# Altium schematic sheet LM317_PSU.SchDoc
size 234 x 100 mm
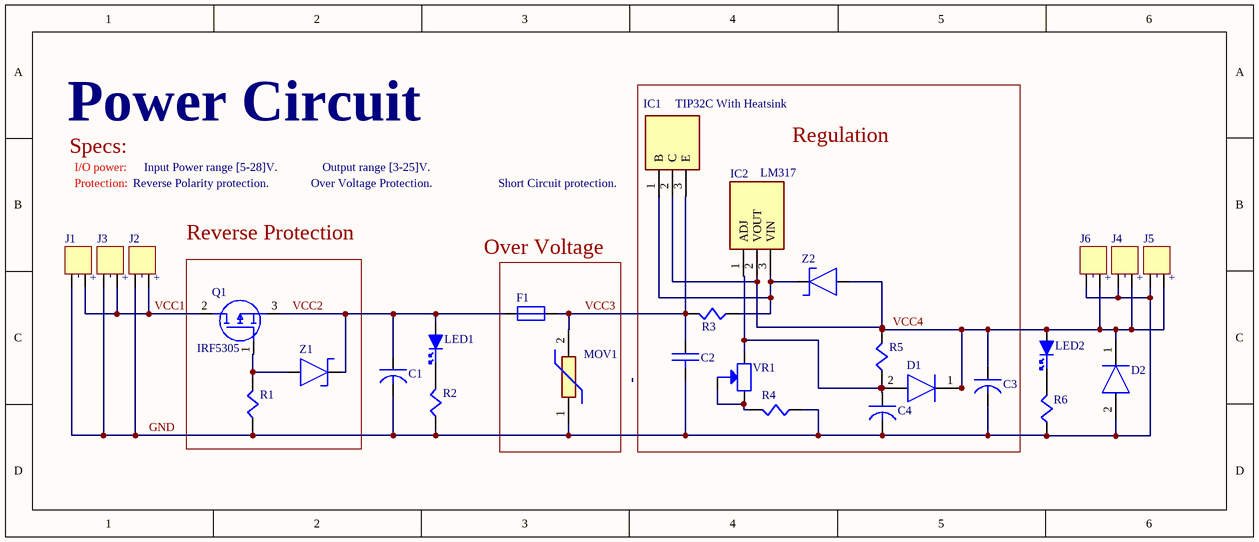
[diagram p0: LM317_PSU.SchDoc]

## Parts
C1  Polarized Cap 100uF 50V  [Cap 5.08mm Radial]  (value not drawn)
C2  Cap Ceramic 100nF 50V  [Cap Ceramic 104]  (value not drawn)
C3  Polarized Cap 33u 50V  [Capacitor 2.54mm 7mmRadial]  (value not drawn)
C4  Polarized Cap 10uF 50V  [Cap 5.08mm Radial]  (value not drawn)
D1  1N4007  [Diode 2.54mm TH V]  (value not drawn)
D2  1N4007  [Diode 2.54mm TH V]  (value not drawn)
F1  Fuse 6A Ceramic  [Fuse BLX 5*20 TH]  (value not drawn)
IC1  TIP32C With Heatsink  [TIP32C TO-220 TH Heatsink]
IC2  LM317  [LM317M SMT]
J1  Terminal Block Green 5.08mm  [Screw Terminal Block  Pluggable5.08mm TH Green]  (value not drawn)
J2  DC Power Jack PJ002  [DC Power Jack 2.1mm PJ-002AH TH]  (value not drawn)
J3  JST on PCB Connector 2 pins  [JST_B2B TH]  (value not drawn)
J4  JST on PCB Connector 2 pins  [JST_B2B TH]  (value not drawn)
J5  DC Power Jack PJ002  [DC Power Jack 2.1mm PJ-002AH TH]  (value not drawn)
J6  Terminal Block Blue 5.08mm  [Screw Terminal Block  Pluggable5.08mm TH Green]  (value not drawn)
LED1  RED 5mm  [LED 5mm Red TH]  (value not drawn)
LED2  RED 5mm  [LED 5mm Red TH]  (value not drawn)
MOV1  Varistor 30VDC  [Varistor 10mm TH]  (value not drawn)
Q1  IRF5305  [IRF5305 TH TO-220]
R1  100K 0.25W  [Res 2.54mm V TH]  (value not drawn)
R2  1.5K 1W  [Res 2.54mm V TH]  (value not drawn)
R3  0.5R 0.5W  [Res 7.62mm H TH]  (value not drawn)
R4  330R 0.25W  [Res 2.54mm V TH]  (value not drawn)
R5  240R 0.25W  [Res 2.54mm V TH]  (value not drawn)
R6  1.5K 1W  [Res 5.08mm V TH]  (value not drawn)
VR1  Trimmer 5K 0.5W  [Trimmer 2.54mm TH]  (value not drawn)
Z1  Zener 9.1V  [Zener 4mm V TH]  (value not drawn)
Z2  Zener 30V  [Zener 2.54mm V TH]  (value not drawn)

## Blocks framed on the sheet
Regulation: C2-C4 D1 IC1 IC2 R3-R5 VR1 Z2
Reverse Protection: Q1 R1 Z1

## Nets
GND: C1.2 C2.2 C3.2 C4.2 D2.2(A) J1.2 J2.2 J3.2 J4.2 J5.2 J6.2 MOV1.1 R1.1 R2.1 R4.1 R6.1
VCC1: J1.1 J2.1 J3.1 Q1.2(D)
VCC2: C1.1 F1.2 LED1.1 Q1.3(S) Z1.2
VCC3: C2.1 F1.1 IC1.3(E) MOV1.2 R3.2
VCC4: C3.1 D1.1(K) D2.1(K) IC1.2(C) IC2.2(VOUT) J4.1 J5.1 J6.1 LED2.1 R5.2 Z2.1
NetC4_1: C4.1 D1.2(A) IC2.1(ADJ) R5.1 VR1.1
NetIC1_1: IC1.1(B) IC2.3(VIN) R3.1 Z2.2
NetLED1_2: LED1.2 R2.2
NetLED2_2: LED2.2 R6.2
NetQ1_1: Q1.1(G) R1.2 Z1.1
NetR4_2: R4.2 VR1.2 VR1.3

## Notes on the sheet
- Specs:
- Power Circuit
- I/O power:
- Protection:
- (near IC1) Reverse Polarity protection.              Over Voltage Protection.                      Short Circuit protection.
- Input Power range [5-28]V.               Output range [3-25]V.
- Over Voltage
- (in symbol Terminal_Block_2Pos) -; +

## Library data of the parts
C1 = PolarizedCapacitors: Capacitors; Manufacturer: Rubycon; Manufacturer Part Number: 25YXH100MEFC6.3X11; Voltage: 25V; Leakage Current: 3uA; Life (Hours): 5000Hour; Impedance: 220mR; Tolerance: 20%; Ripple Current: 340mA; Lead Diameter: 0.5mm; Supplier 1: Digi-Key; RoHS: Yes; Category: Aluminum Electrolytic Capacitors; Stock 1: 2009; Pricing 1: 1=0.29000, 10=0.20500, 50=0.14320, 100=0.12270, 500=0.09202, 1000=0.07771, 2500=0.07362, 5000=0.06953 (USD); Mount: Through Hole; Case/Package: Radial; Number of Pins: 2; Min Operating Temperature: -40°C; Max Operating Temperature: 105°C; Termination: Radial; Voltage Rating (DC): 25V; Packaging: Bulk; Voltage Rating: 25V; Capacitance: 100uF; Package Quantity: 2000; Diameter: 6.3mm; Height: 11mm; Height - Seated (Max): 0.492inch; Lead Pitch: 2.5mm; Radiation Hardening: No; REACH SVHC: Unknown; ComponentLink1URL: https://datasheet.ciiva.com/11778/0900766b80e2e4c1-11778109.pdf?src-supplier=RSComponents; ComponentLink1Description: https://datasheet.ciiva.com/11778/0900766b80e2e4c1-11778109.pdf?src-supplier=RSComponents; ComponentLink2URL: https://datasheet.ciiva.com/11690/e-yxh-11690895.pdf?src-supplier=Avnet; ComponentLink2Description: https://datasheet.ciiva.com/11690/e-yxh-11690895.pdf?src-supplier=Avnet; ComponentLink3URL: https://datasheet.ciiva.com/17512/e-yxh-17512965.pdf?src-supplier=Avnet+Europe; ComponentLink3Description: https://datasheet.ciiva.com/17512/e-yxh-17512965.pdf?src-supplier=Avnet+Europe; ComponentLink4URL: https://datasheet.ciiva.com/6298/e-yxh-6298618.pdf?src-supplier=Digi-Key; ComponentLink4Description: https://datasheet.ciiva.com/6298/e-yxh-6298618.pdf?src-supplier=Digi-Key; Supplier Part Number 1: 1189-1898-ND
C2 = Ceramic_Capacitors: Capacitor Ceramic; Manufacturer: KEMET; Manufacturer Part Number: C320C104M5R5TA7301; Lead/Base Style: Straight; Dissipation Factor: 2.5%; Dielectric: X7R; Tolerance: 20%; Lead Diameter: 0.51mm; Supplier 1: Digi-Key; RoHS: Yes; Category: Ceramic Capacitors; Stock 1: 8222; Pricing 1: 1=0.24000, 10=0.16200, 50=0.10800, 100=0.09180, 500=0.06480, 1000=0.05670 (USD); Case/Package: Dipped; Min Operating Temperature: -55°C; Max Operating Temperature: 125°C; Termination: Radial; Capacitance: 100nF; Packaging: Tape and Reel; Package Quantity: 2500; Voltage Rating: 50V; Length: 6.6mm; Width: 5.08mm; Height: 3.18mm; Lead Pitch: 2.54mm; Depth: 3.18mm; ComponentLink1URL: https://datasheet.ciiva.com/5396/f3101-goldmax-5396597.pdf?src-supplier=Mouser; ComponentLink1Description: https://datasheet.ciiva.com/5396/f3101-goldmax-5396597.pdf?src-supplier=Mouser; Supplier Part Number 1: 399-13978-1-ND
C3 C4 = PolarizedCapacitors: Capacitors; Manufacturer: Rubycon; Manufacturer Part Number: 25YXH100MEFC6.3X11; Voltage: 25V; Leakage Current: 3uA; Life (Hours): 5000Hour; Impedance: 220mR; Capacitance: 100uF; Tolerance: 20%; Ripple Current: 340mA; Lead Diameter: 0.5mm; Supplier 1: Digi-Key; RoHS: Yes; Category: Aluminum Electrolytic Capacitors; Stock 1: 2009; Pricing 1: 1=0.29000, 10=0.20500, 50=0.14320, 100=0.12270, 500=0.09202, 1000=0.07771, 2500=0.07362, 5000=0.06953 (USD); Mount: Through Hole; Case/Package: Radial; Number of Pins: 2; Min Operating Temperature: -40°C; Max Operating Temperature: 105°C; Termination: Radial; Voltage Rating (DC): 25V; Packaging: Bulk; Voltage Rating: 25V; Package Quantity: 2000; Diameter: 6.3mm; Height: 11mm; Height - Seated (Max): 0.492inch; Lead Pitch: 2.5mm; Radiation Hardening: No; REACH SVHC: Unknown; ComponentLink1URL: https://datasheet.ciiva.com/11778/0900766b80e2e4c1-11778109.pdf?src-supplier=RSComponents; ComponentLink1Description: https://datasheet.ciiva.com/11778/0900766b80e2e4c1-11778109.pdf?src-supplier=RSComponents; ComponentLink2URL: https://datasheet.ciiva.com/11690/e-yxh-11690895.pdf?src-supplier=Avnet; ComponentLink2Description: https://datasheet.ciiva.com/11690/e-yxh-11690895.pdf?src-supplier=Avnet; ComponentLink3URL: https://datasheet.ciiva.com/17512/e-yxh-17512965.pdf?src-supplier=Avnet+Europe; ComponentLink3Description: https://datasheet.ciiva.com/17512/e-yxh-17512965.pdf?src-supplier=Avnet+Europe; ComponentLink4URL: https://datasheet.ciiva.com/6298/e-yxh-6298618.pdf?src-supplier=Digi-Key; ComponentLink4Description: https://datasheet.ciiva.com/6298/e-yxh-6298618.pdf?src-supplier=Digi-Key; Supplier Part Number 1: 1189-1898-ND
D1 D2 = Diodes: Manufacturer_Name: Vishay; Manufacturer_Part_Number: 1N4007-E3/53; Datasheet Link: http://www.vishay.com/docs/88503/1n4001.pdf; Arrow Part Number: 1N4007-E3/53; Arrow Price/Stock: https://www.arrow.com/en/products/1n4007-e353/vishay; Mouser Part Number: 625-1N4007-E3/53; Mouser Price/Stock: https://www.mouser.co.uk/ProductDetail/Vishay-General-Semiconductor/1N4007-E3-53?qs=N4vtoAxH%2FSpFgYSIWmQOdg%3D%3D
F1 = Fuses: Fuse; Manufacturer: Schurter; Manufacturer Part Number: 0751.0052; Material: Bronze,Tin; Color: Silver; Body Material: Brass,Bronze; Current Rating: 6.3A; Voltage Rating (AC): 250V; Number of Circuits: 1; Supplier 1: Digi-Key; RoHS: Yes; Category: Fuse Holders; Stock 1: 6794; Pricing 1: 1=0.23000, 50=0.17500, 100=0.15800, 500=0.11900, 1000=0.09240 (USD); Mount: PCB,Through Hole; Case/Package: Radial; Weight: 0.021164oz; Contact Plating: Tin; Contact Material: Bronze; Min Operating Temperature: -40°C; Max Operating Temperature: 85°C; Packaging: Bulk; Package Quantity: 1000; Termination: PC Pin; Orientation: Horizontal; Voltage Rating: 250V; Length: 5mm; Width: 6mm; Height: 12mm; Depth: 6.4mm; Radiation Hardening: No; Lead Free: Lead Free; ComponentLink1URL: https://datasheet.ciiva.com/298/typ-og-clip-5x20-298130.pdf?src-supplier=Mouser; ComponentLink1Description: https://datasheet.ciiva.com/298/typ-og-clip-5x20-298130.pdf?src-supplier=Mouser; ComponentLink2URL: https://datasheet.ciiva.com/17406/typ-og-clip-5x20-17406545.pdf?src-supplier=Avnet+Europe; ComponentLink2Description: https://datasheet.ciiva.com/17406/typ-og-clip-5x20-17406545.pdf?src-supplier=Avnet+Europe; ComponentLink3URL: https://datasheet.ciiva.com/3014/typ-og-clip-5x20-3014741.pdf?src-supplier=Avnet; ComponentLink3Description: https://datasheet.ciiva.com/3014/typ-og-clip-5x20-3014741.pdf?src-supplier=Avnet; ComponentLink4URL: https://datasheet.ciiva.com/295/typ-og-clip-5x20-295734.pdf?src-supplier=Digi-Key; ComponentLink4Description: https://datasheet.ciiva.com/295/typ-og-clip-5x20-295734.pdf?src-supplier=Digi-Key; ComponentLink5URL: https://datasheet.ciiva.com/16215/629typ-og-clip-5x20-16215174.pdf?src-supplier=Onlinecomponents.com; ComponentLink5Description: https://datasheet.ciiva.com/16215/629typ-og-clip-5x20-16215174.pdf?src-supplier=Onlinecomponents.com; ComponentLink6URL: https://datasheet.ciiva.com/14102/zoog-clip-5x20-e-14102796.pdf?src-supplier=Distrelec; ComponentLink6Description: https://datasheet.ciiva.com/14102/zoog-clip-5x20-e-14102796.pdf?src-supplier=Distrelec; ComponentLink7URL: https://datasheet.ciiva.com/15188/getdatasheetpartid-392158-15188044.pdf?src-supplier=Verical; ComponentLink7Description: https://datasheet.ciiva.com/15188/getdatasheetpartid-392158-15188044.pdf?src-supplier=Verical; ComponentLink8URL: https://datasheet.ciiva.com/16381/typ-og-clip-5x20-16381548.pdf?src-supplier=Future+Electronics; ComponentLink8Description: https://datasheet.ciiva.com/16381/typ-og-clip-5x20-16381548.pdf?src-supplier=Future+Electronics; ComponentLink9URL: https://datasheet.ciiva.com/16463/typ-og-clip-5x20-16463852.pdf?src-supplier=Avnet+Asia; ComponentLink9Description: https://datasheet.ciiva.com/16463/typ-og-clip-5x20-16463852.pdf?src-supplier=Avnet+Asia; ComponentLink10URL: https://datasheet.ciiva.com/30196/typ-og-clip-5x20-30196268.pdf?src-supplier=Onlinecomponents.com; ComponentLink10Description: https://datasheet.ciiva.com/30196/typ-og-clip-5x20-30196268.pdf?src-supplier=Onlinecomponents.com; Supplier Part Number 1: 486-1173-ND
IC1 = TIP32C: Integrated Circuit; Manufacturer_Name: STMicroelectronics; Datasheet Link: http://www.st.com/web/en/resource/technical/document/datasheet/CD00145629.pdf; Height: 4.6mm; Manufacturer_Part_Number: TIP32C; Arrow Part Number: TIP32C; Arrow Price/Stock: https://www.arrow.com/en/products/tip32c/stmicroelectronics; Mouser Part Number: 511-TIP32C; Mouser Price/Stock: https://www.mouser.co.uk/ProductDetail/STMicroelectronics/TIP32C?qs=ljbEvF4DwONbJ5tF0yFRvw%3D%3D
IC2 = LM317: IC; Manufacturer_Name: Texas Instruments; Manufacturer_Part_Number: LM317T; Datasheet Link: http://www.ti.com/general/docs/lit/getliterature.tsp?genericPartNumber=LM317-N&fileType=pdf; Height: 4.7mm; Arrow Part Number: LM317T; Arrow Price/Stock: https://www.arrow.com/en/products/lm317t/texas-instruments; Mouser Part Number: 926-LM317T; Mouser Price/Stock: https://www.mouser.co.uk/ProductDetail/Texas-Instruments/LM317T?qs=X1J7HmVL2ZGY%2FgfLis%252BFJQ%3D%3D
J1 J6 = Terminal_Block_2Pos: Terminals 2POS; Manufacturer: Phoenix Contact; Manufacturer Part Number: 1729128; Current Rating: 13.5A; Number of Poles: 2; Voltage Rating: 400V; Number of Levels: 1; Current: 10A; Voltage: 300V; Connector Type: Screw; Test Voltage: 4kV; Wire Gauge (Max): 26AWG; Wire Gauge (Min): 14AWG; Approvals: UL,CSA; Supplier 1: Digi-Key; RoHS: Yes; Category: Terminal Blocks; Stock 1: 9869; Pricing 1: 1=1.09000, 10=1.04700, 50=1.00100, 100=0.97370, 250=0.91000, 500=0.83720, 1000=0.77350, 2500=0.73710, 5000=0.69160 (USD); Mount: Through Hole; Number of Pins: 2; Housing Material: Polyamide; Color: Green; Weight: 0.069842oz; Housing Color: Green; Insulation Material: Nylon; Contact Material: Tin; Min Operating Temperature: -20°C; Max Operating Temperature: 100°C; Package Quantity: 50; Packaging: Bulk; Termination: Screw; Max Current Rating: 13.5A; Number of Rows: 1; Max Supply Voltage: 400V; Number of Positions Per Level: 2; Number of Positions: 2; Number of Contacts: 2; Number of Circuits: 2; Orientation: Straight; Length: 8.1mm; Width: 13.5mm; Height: 13.5mm; Depth: 8.1mm; Wire/Cable Gauge: 26AWG; Pitch: 5.08mm; Radiation Hardening: No; Lead Free: Lead Free; REACH SVHC: No SVHC; Flammability Rating: UL94 V-0; ComponentLink1URL: https://datasheet.ciiva.com/823/1729128-823779.pdf?src-supplier=Digi-Key; ComponentLink1Description: https://datasheet.ciiva.com/823/1729128-823779.pdf?src-supplier=Digi-Key; ComponentLink2URL: https://datasheet.ciiva.com/15169/getdatasheetpartid-199310-15169845.pdf?src-supplier=Verical; ComponentLink2Description: https://datasheet.ciiva.com/15169/getdatasheetpartid-199310-15169845.pdf?src-supplier=Verical; ComponentLink3URL: https://datasheet.ciiva.com/16046/1729128-16046181.pdf?src-supplier=Onlinecomponents.com; ComponentLink3Description: https://datasheet.ciiva.com/16046/1729128-16046181.pdf?src-supplier=Onlinecomponents.com; ComponentLink4URL: https://datasheet.ciiva.com/14607/70054405-14607157.pdf?src-supplier=Allied+Electronics; ComponentLink4Description: https://datasheet.ciiva.com/14607/70054405-14607157.pdf?src-supplier=Allied+Electronics; ComponentLink5URL: https://datasheet.ciiva.com/29218/743664-da-01-en-printklemmenblock-mkdsn-1-5-2-5-08-29218154.pdf?src-supplier=Conrad; ComponentLink5Description: https://datasheet.ciiva.com/29218/743664-da-01-en-printklemmenblock-mkdsn-1-5-2-5-08-29218154.pdf?src-supplier=Conrad; Supplier Part Number 1: 277-1247-ND
J2-J5 = Terminal_Block_2Pos: Terminals 2POS; Manufacturer: Phoenix Contact; Manufacturer Part Number: 1729128; Current Rating: 13.5A; Number of Poles: 2; Voltage Rating: 400V; Number of Levels: 1; Current: 10A; Voltage: 300V; Connector Type: Screw; Test Voltage: 4kV; Wire Gauge (Max): 26AWG; Wire Gauge (Min): 14AWG; Pitch: 5.08mm; Approvals: UL,CSA; Supplier 1: Digi-Key; RoHS: Yes; Category: Terminal Blocks; Stock 1: 9869; Pricing 1: 1=1.09000, 10=1.04700, 50=1.00100, 100=0.97370, 250=0.91000, 500=0.83720, 1000=0.77350, 2500=0.73710, 5000=0.69160 (USD); Mount: Through Hole; Number of Pins: 2; Housing Material: Polyamide; Color: Green; Weight: 0.069842oz; Housing Color: Green; Insulation Material: Nylon; Contact Material: Tin; Min Operating Temperature: -20°C; Max Operating Temperature: 100°C; Package Quantity: 50; Packaging: Bulk; Termination: Screw; Max Current Rating: 13.5A; Number of Rows: 1; Max Supply Voltage: 400V; Number of Positions Per Level: 2; Number of Positions: 2; Number of Contacts: 2; Number of Circuits: 2; Orientation: Straight; Length: 8.1mm; Width: 13.5mm; Height: 13.5mm; Depth: 8.1mm; Wire/Cable Gauge: 26AWG; Radiation Hardening: No; Lead Free: Lead Free; REACH SVHC: No SVHC; Flammability Rating: UL94 V-0; ComponentLink1URL: https://datasheet.ciiva.com/823/1729128-823779.pdf?src-supplier=Digi-Key; ComponentLink1Description: https://datasheet.ciiva.com/823/1729128-823779.pdf?src-supplier=Digi-Key; ComponentLink2URL: https://datasheet.ciiva.com/15169/getdatasheetpartid-199310-15169845.pdf?src-supplier=Verical; ComponentLink2Description: https://datasheet.ciiva.com/15169/getdatasheetpartid-199310-15169845.pdf?src-supplier=Verical; ComponentLink3URL: https://datasheet.ciiva.com/16046/1729128-16046181.pdf?src-supplier=Onlinecomponents.com; ComponentLink3Description: https://datasheet.ciiva.com/16046/1729128-16046181.pdf?src-supplier=Onlinecomponents.com; ComponentLink4URL: https://datasheet.ciiva.com/14607/70054405-14607157.pdf?src-supplier=Allied+Electronics; ComponentLink4Description: https://datasheet.ciiva.com/14607/70054405-14607157.pdf?src-supplier=Allied+Electronics; ComponentLink5URL: https://datasheet.ciiva.com/29218/743664-da-01-en-printklemmenblock-mkdsn-1-5-2-5-08-29218154.pdf?src-supplier=Conrad; ComponentLink5Description: https://datasheet.ciiva.com/29218/743664-da-01-en-printklemmenblock-mkdsn-1-5-2-5-08-29218154.pdf?src-supplier=Conrad; Supplier Part Number 1: 277-1247-ND
LED1 LED2 = LEDs_Single: LEDs; Manufacturer: Vishay Semiconductors; Manufacturer Part Number: TLDR5400; Dominant Wavelength: 648nm; Test Current: 20mA; Lens Transparency: Diffused; Number of Elements: 1; Power Dissipation: 100mW; Wavelength: 650nm; Luminous Intensity: 70mcd; Viewing Angle: 30°; Forward Voltage: 1.8V; Lens Style: Diffused,Dome,Colored,Circular,Round; Reverse Voltage: 6V; Lead Length: 24mm; Supplier 1: Allied Electronics; RoHS: Yes; Category: LEDs; Pricing 1: 4000=0.13000, 40000=0.12800, 100000=0.12600 (USD); Mount: Through Hole; Case/Package: Radial; Number of Pins: 2; Color: Red; Min Operating Temperature: -40°C; Max Operating Temperature: 100°C; Number of LEDs: 1; Forward Current: 20mA; Packaging: Bulk; Package Quantity: 4000; Illumination Color: Red; Diameter: 5mm; Length: 5.8mm; Height: 8.7mm; Depth: 5.8mm; Radiation Hardening: No; REACH SVHC: Unknown; ComponentLink1URL: https://datasheet.ciiva.com/28652/tldr5400-28652624.pdf?src-supplier=Element14; ComponentLink1Description: https://datasheet.ciiva.com/28652/tldr5400-28652624.pdf?src-supplier=Element14; ComponentLink2URL: https://datasheet.ciiva.com/7639/6597-7639122.pdf?src-supplier=Element14; ComponentLink2Description: https://datasheet.ciiva.com/7639/6597-7639122.pdf?src-supplier=Element14; ComponentLink3URL: https://datasheet.ciiva.com/4691/tldr5400-240375-4691911.pdf?src-supplier=Mouser; ComponentLink3Description: https://datasheet.ciiva.com/4691/tldr5400-240375-4691911.pdf?src-supplier=Mouser; ComponentLink4URL: https://datasheet.ciiva.com/18446/70061525-18446460.pdf?src-supplier=Allied+Electronics; ComponentLink4Description: https://datasheet.ciiva.com/18446/70061525-18446460.pdf?src-supplier=Allied+Electronics; Supplier Part Number 1: 70061525
MOV1 = Varistor: Varistors; Manufacturer_Name: 3ALOGICS; Manufacturer_Part_Number: 220KD10; Datasheet Link: https://lcsc.com/product-detail/Varistors_220KD10_C84758.html; Height: 16mm
Q1 = IRF5305: MOSFET (P-Channel); Manufacturer_Name: Infineon; Manufacturer_Part_Number: IRF5305PBF; Datasheet Link: https://www.infineon.com/dgdl/irf5305pbf.pdf?fileId=5546d462533600a4015355e370101993; Height: 4.69mm; Arrow Part Number: IRF5305PBF; Arrow Price/Stock: https://www.arrow.com/en/products/irf5305pbf/infineon-technologies-ag; Mouser Part Number: 942-IRF5305PBF; Mouser Price/Stock: https://www.mouser.co.uk/ProductDetail/Infineon-Technologies/IRF5305PBF?qs=9%252BKlkBgLFf3WAOOEkAEJ1w%3D%3D
R1-R6 = Resistors_Single: Resistors; Manufacturer: Yageo; Manufacturer Part Number: CFR-25JB-52-100K; Max Power Dissipation: 250mW; Resistance: 100kR; Tolerance: 5%; Temperature Coefficient: -700ppm/°C; Supplier 1: Digi-Key; RoHS: Yes; Category: Through-Hole Resistors; Stock 1: 105911; Pricing 1: 1=0.10000, 25=0.04640, 50=0.03600, 100=0.02580, 250=0.02008, 500=0.01596, 750=0.01365, 1000=0.01133, 2000=0.00979 (USD); Case/Package: Axial; Min Operating Temperature: -55°C; Max Operating Temperature: 155°C; Package Quantity: 200; Packaging: Bulk; Power Rating: 250mW; Number of Terminations: 2; Resistor Type: Carbon Film; Length: 0.248inch; Lead Free: Lead Free; ComponentLink1URL: http://www.yageo.com/NewPortal/yageodocoutput?fileName=/pdf/throughhole/Yageo_LR_CFR_2013.pdf&src-supplier=Digi-Key; ComponentLink1Description: http://www.yageo.com/NewPortal/yageodocoutput?fileName=/pdf/throughhole/Yageo_LR_CFR_2013.pdf&src-supplier=Digi-Key; ComponentLink2URL: http://www.yageo.com/documents/recent/General%20Type_CFR.pdf?src-supplier=Future+Electronics; ComponentLink2Description: http://www.yageo.com/documents/recent/General%20Type_CFR.pdf?src-supplier=Future+Electronics; Supplier Part Number 1: 100KQBK-ND
VR1 = VariableResistors: Variable Resistors; Manufacturer: Bourns; Manufacturer Part Number: 3296W-1-502RLF; Number of Turns: 25; Temperature Coefficient: 100ppm/°C; Power Rating: 500mW; Resistance: 5kR; Tolerance: 10%; Supplier 1: Digi-Key; RoHS: Yes; Category: Variable Resistors and Potentiometers; Stock 1: 1194; Pricing 1: 1=3.74000, 10=3.27600, 25=2.92520, 50=2.74960, 100=2.69100, 250=2.57400, 500=2.10600 (USD); Mount: Through Hole; Weight: 0.03oz; Min Operating Temperature: -55°C; Max Operating Temperature: 125°C; Termination: Pin; Taper: Linear; Packaging: Tape and Reel; Max Power Dissipation: 500mW; Package Quantity: 1000; Resistor Type: Cermet; Length: 9.53mm; Width: 4.83mm; Height: 0.395inch; Depth: 4.83mm; Radiation Hardening: No; Military Standard: Not; ComponentLink1URL: https://datasheet.ciiva.com/8088/3296-8088713.pdf?src-supplier=Avnet; ComponentLink1Description: https://datasheet.ciiva.com/8088/3296-8088713.pdf?src-supplier=Avnet; ComponentLink2URL: https://datasheet.ciiva.com/16807/3296-16807737.pdf?src-supplier=Avnet+Europe; ComponentLink2Description: https://datasheet.ciiva.com/16807/3296-16807737.pdf?src-supplier=Avnet+Europe; ComponentLink3URL: https://datasheet.ciiva.com/2162/3296-2162778.pdf?src-supplier=Digi-Key; ComponentLink3Description: https://datasheet.ciiva.com/2162/3296-2162778.pdf?src-supplier=Digi-Key; Supplier Part Number 1: 3296W-1-502RLFCT-ND
Z1 = Zener: Zeners; Manufacturer: NXP Semiconductors; Manufacturer Part Number: BZX79-C9V1,113; ESD Protection: No; Tolerance: 5%; Forward Voltage: 900mV; Zener Voltage: 9.05V; Max Power Dissipation: 400mW; Impedance: 15R; Max Reverse Leakage Current: 500nA; Power Dissipation: 500mW; Test Current: 5mA; Element Configuration: Single; Supplier 1: Digi-Key; RoHS: Yes; Category: Zener Diodes; Stock 1: 5212; Pricing 1: 1=0.13000, 10=0.11700, 100=0.04900, 500=0.03844, 1000=0.02670, 2000=0.02332, 5000=0.02092 (USD); Mount: Through Hole; Number of Pins: 2; Contact Plating: Tin; Weight: 0.01lb; Min Operating Temperature: -65°C; Max Operating Temperature: 200°C; Packaging: Tape and Reel; Package Quantity: 10000; Voltage Tolerance: 5%; Working Voltage: 9.1V; Max Reverse Current: 500nA; Length: 4.25mm; Width: 1.85mm; Height: 1.85mm; Radiation Hardening: No; REACH SVHC: No SVHC; Lead Free: Lead Free; ComponentLink1URL: https://datasheet.ciiva.com/16211/bzx79-16211546.pdf?src-supplier=Future+Electronics; ComponentLink1Description: https://datasheet.ciiva.com/16211/bzx79-16211546.pdf?src-supplier=Future+Electronics; ComponentLink2URL: https://datasheet.ciiva.com/889/bzx79-889298.pdf?src-supplier=Digi-Key; ComponentLink2Description: https://datasheet.ciiva.com/889/bzx79-889298.pdf?src-supplier=Digi-Key; ComponentLink3URL: https://datasheet.ciiva.com/889/bzx79-889302.pdf?src-supplier=Digi-Key; ComponentLink3Description: https://datasheet.ciiva.com/889/bzx79-889302.pdf?src-supplier=Digi-Key; ComponentLink4URL: https://datasheet.ciiva.com/8347/bzx79-8347356.pdf?src-supplier=Avnet; ComponentLink4Description: https://datasheet.ciiva.com/8347/bzx79-8347356.pdf?src-supplier=Avnet; ComponentLink5URL: https://datasheet.ciiva.com/16559/bzx79-16559628.pdf?src-supplier=Avnet+Europe; ComponentLink5Description: https://datasheet.ciiva.com/16559/bzx79-16559628.pdf?src-supplier=Avnet+Europe; Supplier Part Number 1: 1727-2123-1-ND
Z2 = Zener: Zeners; Manufacturer: NXP Semiconductors; Manufacturer Part Number: BZX79-C9V1,113; ESD Protection: No; Tolerance: 5%; Forward Voltage: 900mV; Zener Voltage: 9.05V; Max Power Dissipation: 400mW; Impedance: 15R; Max Reverse Leakage Current: 500nA; Power Dissipation: 500mW; Test Current: 5mA; Working Voltage: 9.1V; Element Configuration: Single; Supplier 1: Digi-Key; RoHS: Yes; Category: Zener Diodes; Stock 1: 5212; Pricing 1: 1=0.13000, 10=0.11700, 100=0.04900, 500=0.03844, 1000=0.02670, 2000=0.02332, 5000=0.02092 (USD); Mount: Through Hole; Number of Pins: 2; Contact Plating: Tin; Weight: 0.01lb; Min Operating Temperature: -65°C; Max Operating Temperature: 200°C; Packaging: Tape and Reel; Package Quantity: 10000; Voltage Tolerance: 5%; Max Reverse Current: 500nA; Length: 4.25mm; Width: 1.85mm; Height: 1.85mm; Radiation Hardening: No; REACH SVHC: No SVHC; Lead Free: Lead Free; ComponentLink1URL: https://datasheet.ciiva.com/16211/bzx79-16211546.pdf?src-supplier=Future+Electronics; ComponentLink1Description: https://datasheet.ciiva.com/16211/bzx79-16211546.pdf?src-supplier=Future+Electronics; ComponentLink2URL: https://datasheet.ciiva.com/889/bzx79-889298.pdf?src-supplier=Digi-Key; ComponentLink2Description: https://datasheet.ciiva.com/889/bzx79-889298.pdf?src-supplier=Digi-Key; ComponentLink3URL: https://datasheet.ciiva.com/889/bzx79-889302.pdf?src-supplier=Digi-Key; ComponentLink3Description: https://datasheet.ciiva.com/889/bzx79-889302.pdf?src-supplier=Digi-Key; ComponentLink4URL: https://datasheet.ciiva.com/8347/bzx79-8347356.pdf?src-supplier=Avnet; ComponentLink4Description: https://datasheet.ciiva.com/8347/bzx79-8347356.pdf?src-supplier=Avnet; ComponentLink5URL: https://datasheet.ciiva.com/16559/bzx79-16559628.pdf?src-supplier=Avnet+Europe; ComponentLink5Description: https://datasheet.ciiva.com/16559/bzx79-16559628.pdf?src-supplier=Avnet+Europe; Supplier Part Number 1: 1727-2123-1-ND